# EAGLE schematic DIDV_-_Expansao_10 (EAGLE 6.2)

## Sheet 1 of 4
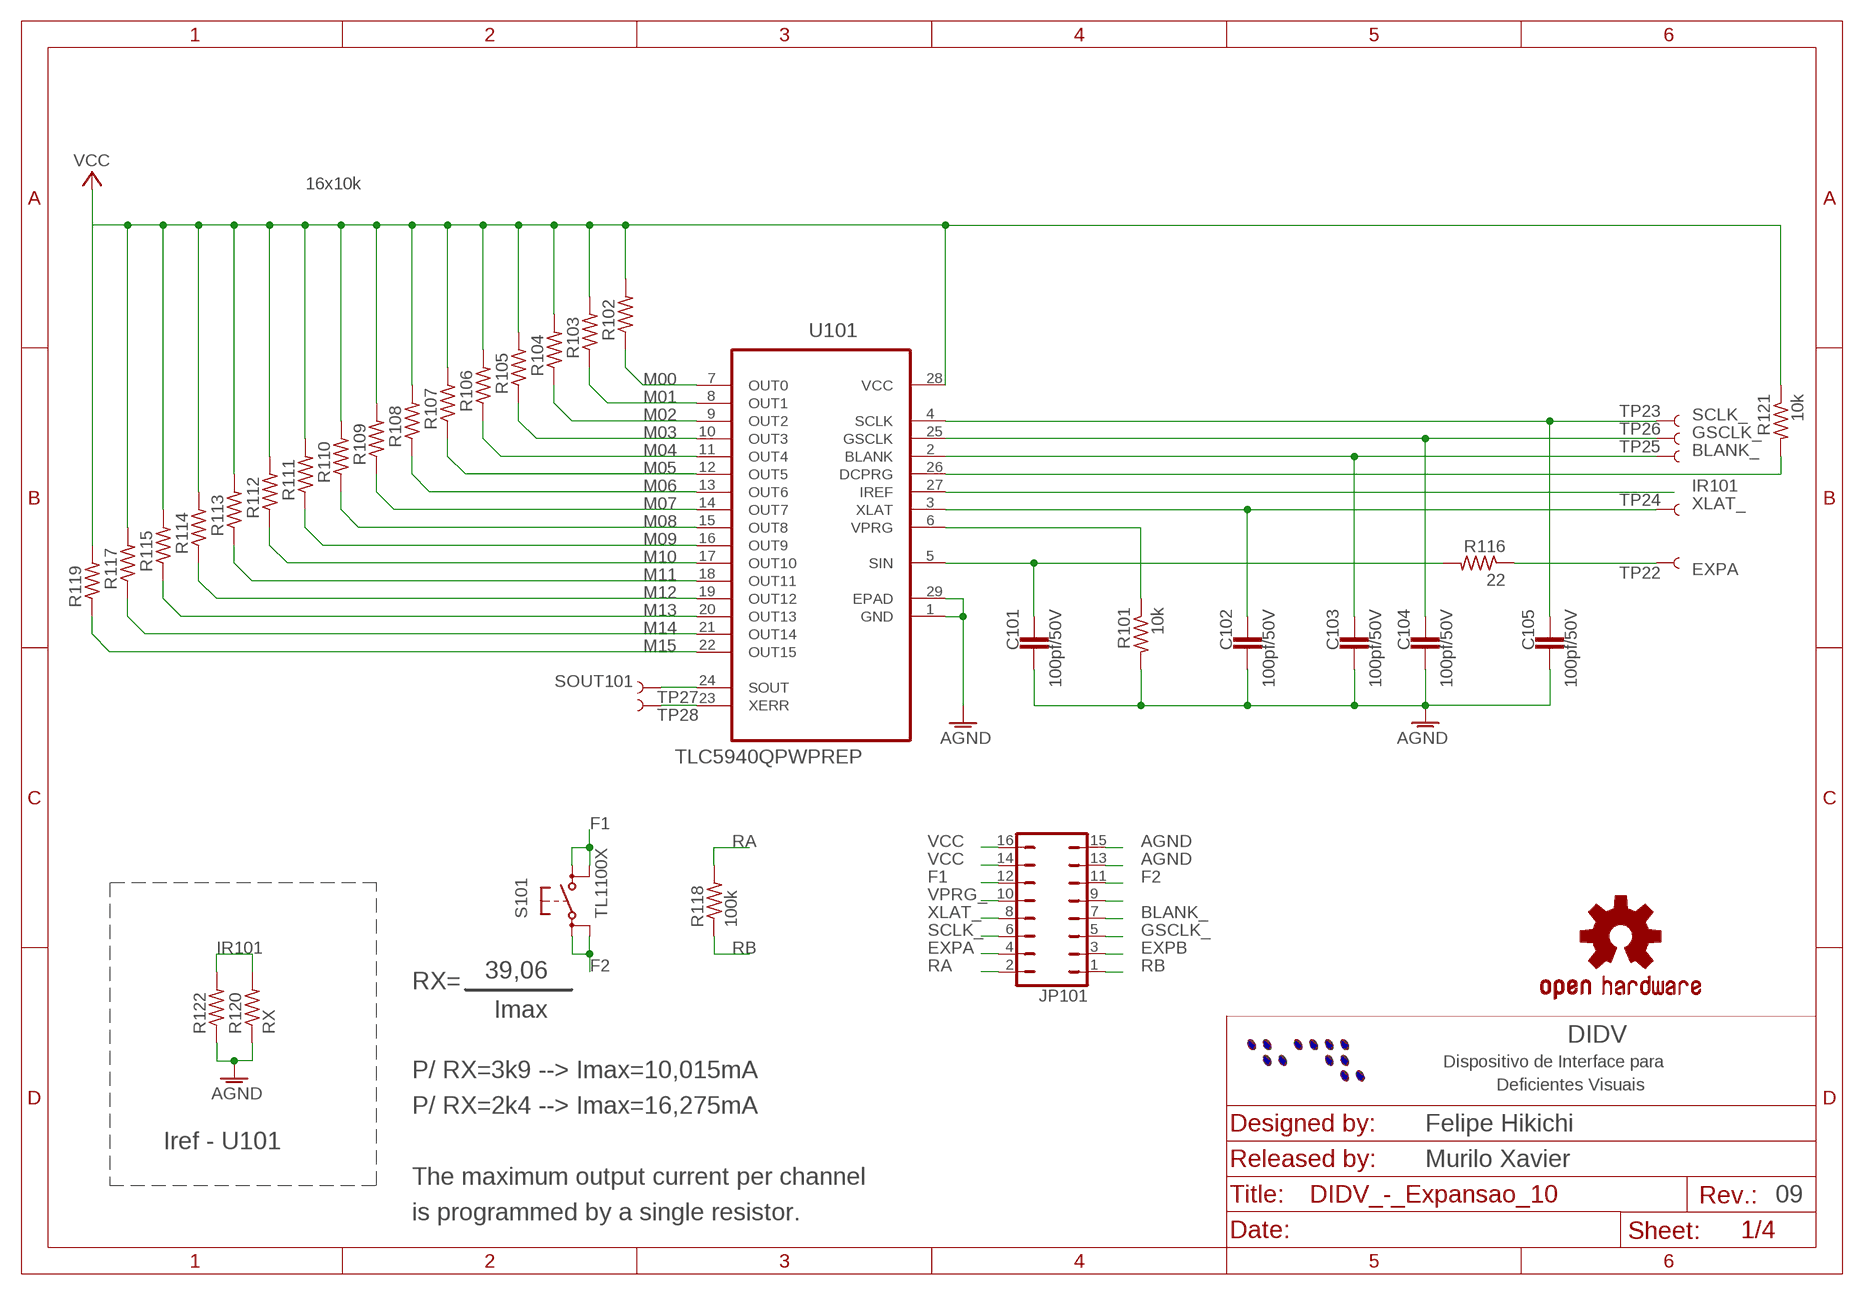
[diagram p0: schematic, sheet 1]

### Parts
C101  100pf/50V  C-EUC0603K  [C0603K]
C102  100pf/50V  C-EUC0603K  [C0603K]
C103  100pf/50V  C-EUC0603K  [C0603K]
C104  100pf/50V  C-EUC0603K  [C0603K]
C105  100pf/50V  C-EUC0603K  [C0603K]
JP101  JP8Q  [JP8Q]
LOGO101  OSHW-LOGOM  [OSHW-LOGO-M]
R101  10k  R-US_R0603  [R0603]
R102  R-US_R0805  [R0805]
R103  R-US_R0805  [R0805]
R104  R-US_R0805  [R0805]
R105  R-US_R0805  [R0805]
R106  R-US_R0805  [R0805]
R107  R-US_R0805  [R0805]
R108  R-US_R0805  [R0805]
R109  R-US_R0805  [R0805]
R110  R-US_R0805  [R0805]
R111  R-US_R0805  [R0805]
R112  R-US_R0805  [R0805]
R113  R-US_R0805  [R0805]
R114  R-US_R0805  [R0805]
R115  R-US_R0805  [R0805]
R116  22  R-US_R0603  [R0603]
R117  R-US_R0805  [R0805]
R118  100k  R-US_R0805  [R0805]
R119  R-US_R0805  [R0805]
R120  RX  R-US_R0805  [R0805]
R121  10k  R-US_R0603  [R0603]
R122  R-US_R0805  [R0805]
S101  TL1100X  [TL1100X]
TP22  TEST-POINT3X4  [PAD.03X.04]
TP23  TEST-POINT3X4  [PAD.03X.04]
TP24  TEST-POINT3X4  [PAD.03X.04]
TP25  TEST-POINT3X4  [PAD.03X.04]
TP26  TEST-POINT3X4  [PAD.03X.04]
TP27  TEST-POINT3X4  [PAD.03X.04]
TP28  TEST-POINT3X4  [PAD.03X.04]
U101  TLC5940QPWPREP  [SOP65P640X120-29N]

### Nets
AGND: C101.1 C102.1 C103.1 C104.1 C105.1 JP101.13 JP101.15 R101.2 R120.1 R122.1 U101.1(GND) U101.29(EPAD) ; also sheet 2,3,4
BLANK_: C103.2 JP101.7 TP25.P$1 U101.2(BLANK) ; also sheet 2,3,4
EXPA: JP101.4 R116.1 TP22.P$1
EXPB: JP101.3 ; also sheet 4
F1: JP101.12 S101.3(S) S101.4(S1)
F2: JP101.11 S101.1(P) S101.2(P1)
GSCLK_: C104.2 JP101.5 TP26.P$1 U101.25(GSCLK) ; also sheet 2,3,4
IR101: R120.2 R122.2 U101.27(IREF)
M00: R102.1 U101.7(OUT0) ; also sheet 2,3,4
M01: R103.1 U101.8(OUT1) ; also sheet 2,3,4
M02: R104.1 U101.9(OUT2) ; also sheet 2,3,4
M03: R105.1 U101.10(OUT3) ; also sheet 2,3,4
M04: R106.1 U101.11(OUT4) ; also sheet 2,3,4
M05: R107.1 U101.12(OUT5) ; also sheet 2,3,4
M06: R108.1 U101.13(OUT6) ; also sheet 2,3,4
M07: R109.1 U101.14(OUT7) ; also sheet 2,3,4
M08: R110.1 U101.15(OUT8) ; also sheet 2,3,4
M09: R111.1 U101.16(OUT9) ; also sheet 2,3,4
M10: R112.1 U101.17(OUT10) ; also sheet 2,3,4
M11: R113.1 U101.18(OUT11) ; also sheet 2,3,4
M12: R114.1 U101.19(OUT12) ; also sheet 2,3,4
M13: R115.1 U101.20(OUT13) ; also sheet 2,3,4
M14: R117.1 U101.21(OUT14) ; also sheet 2,3,4
M15: R119.1 U101.22(OUT15) ; also sheet 2,3,4
N$1: R121.2 U101.26(DCPRG)
N$2: JP101.9
N$4: C101.2 R116.2 U101.5(SIN)
N$10: TP28.P$1 U101.23(XERR)
RA: JP101.2 R118.2
RB: JP101.1 R118.1
SCLK_: C105.2 JP101.6 TP23.P$1 U101.4(SCLK) ; also sheet 2,3,4
SOUT101: TP27.P$1 U101.24(SOUT) ; also sheet 2
VCC: JP101.14 JP101.16 R102.2 R103.2 R104.2 R105.2 R106.2 R107.2 R108.2 R109.2 R110.2 R111.2 R112.2 R113.2 R114.2 R115.2 R117.2 R119.2 R121.1 U101.28(VCC) ; also sheet 2,3,4
VPRG_: JP101.10 R101.1 U101.6(VPRG) ; also sheet 2,3,4
XLAT_: C102.2 JP101.8 TP24.P$1 U101.3(XLAT) ; also sheet 2,3,4

### Notes on the sheet
- 16x10k
- 39,06
- RX=
- Imax
- DIDV
- Dispositivo de Interface para
- P/ RX=3k9 --> Imax=10,015mA
- Deficientes Visuais
- P/ RX=2k4 --> Imax=16,275mA
- Felipe Hikichi
- Iref - U101
- Murilo Xavier
- The maximum output current per channel
- 09
- is programmed by a single resistor.

## Sheet 2 of 4
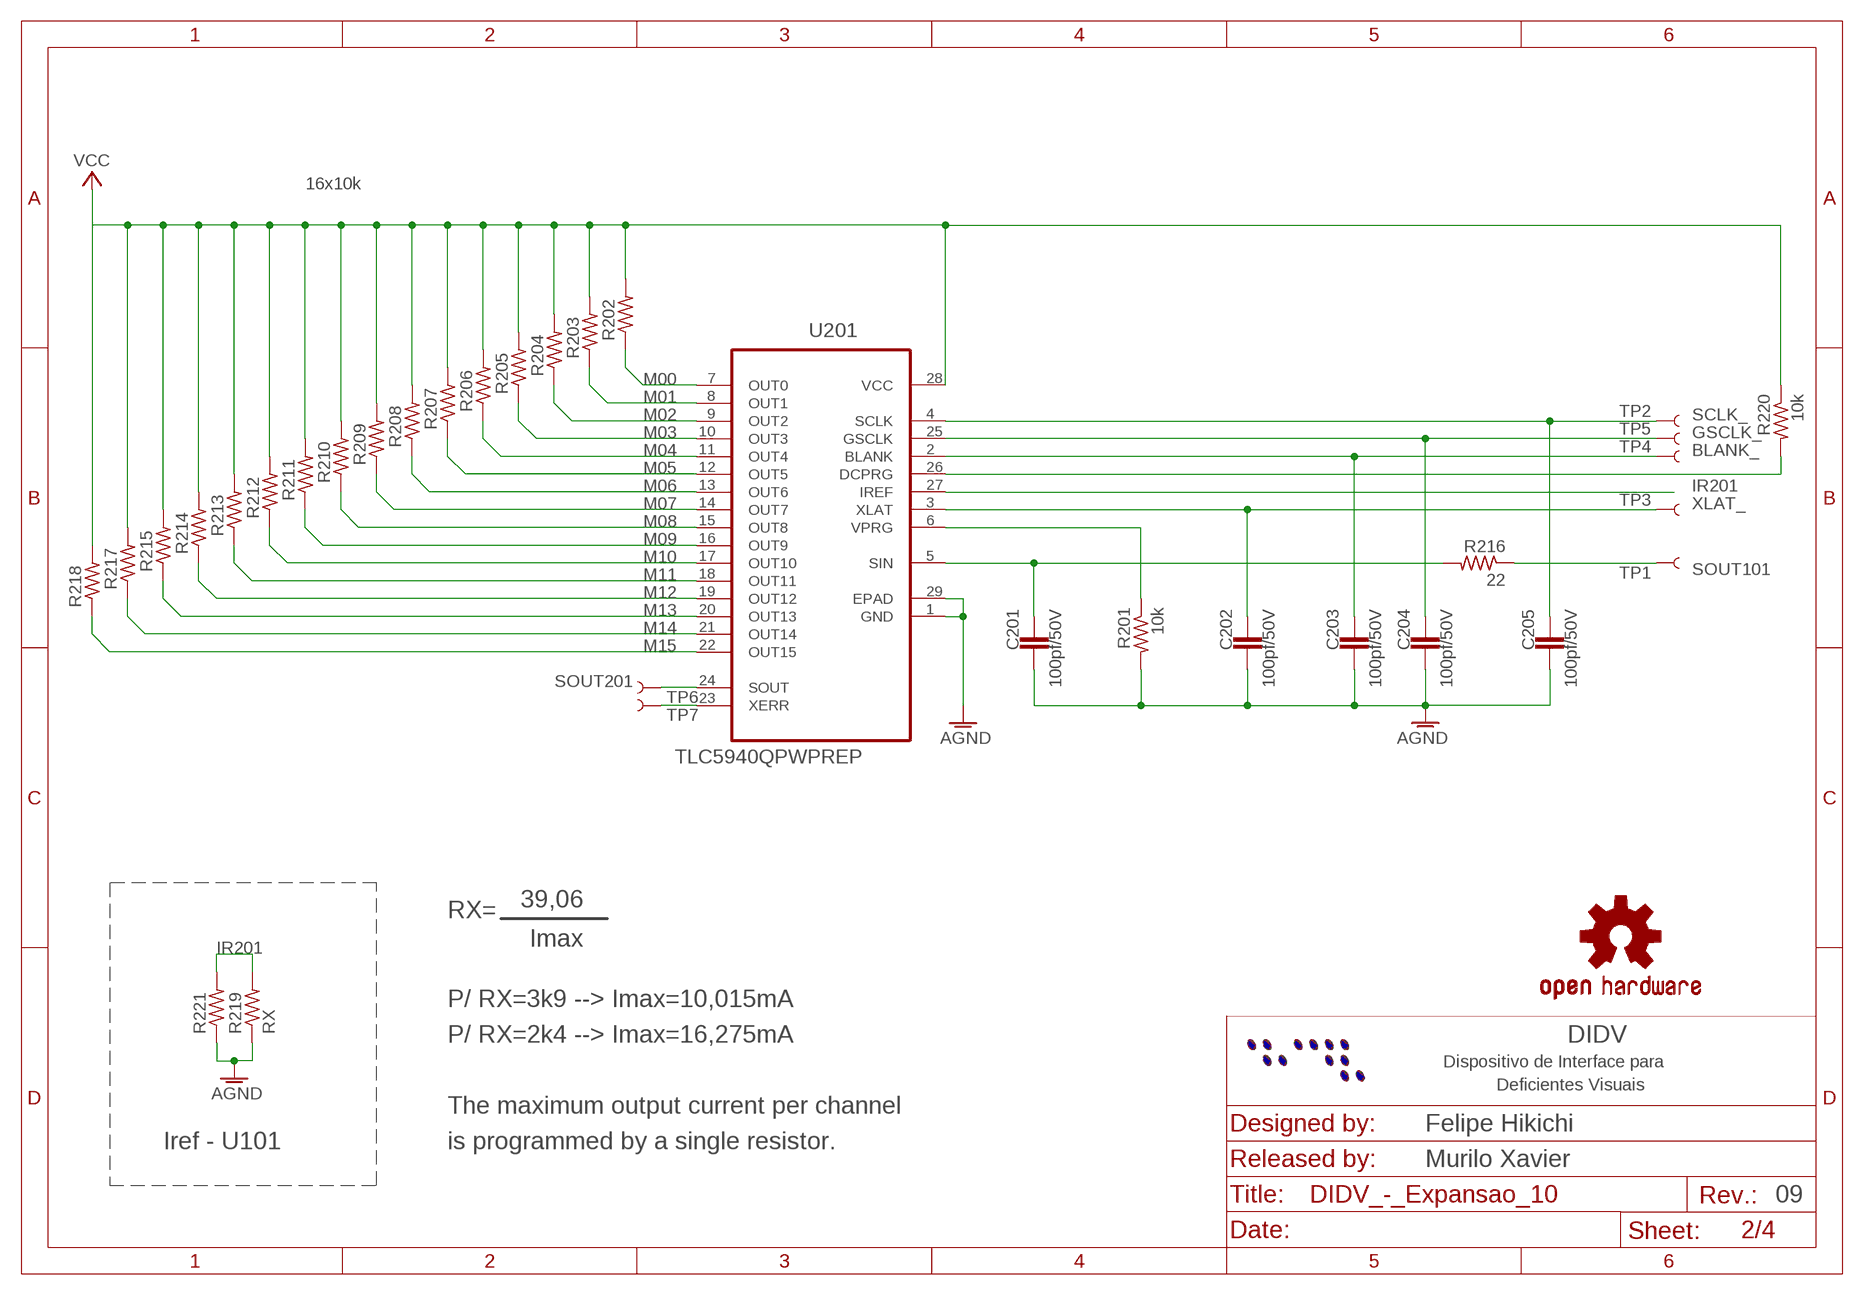
[diagram p1: schematic, sheet 2]

### Parts
C201  100pf/50V  C-EUC0603K  [C0603K]
C202  100pf/50V  C-EUC0603K  [C0603K]
C203  100pf/50V  C-EUC0603K  [C0603K]
C204  100pf/50V  C-EUC0603K  [C0603K]
C205  100pf/50V  C-EUC0603K  [C0603K]
LOGO201  OSHW-LOGOM  [OSHW-LOGO-M]
R201  10k  R-US_R0603  [R0603]
R202  R-US_R0805  [R0805]
R203  R-US_R0805  [R0805]
R204  R-US_R0805  [R0805]
R205  R-US_R0805  [R0805]
R206  R-US_R0805  [R0805]
R207  R-US_R0805  [R0805]
R208  R-US_R0805  [R0805]
R209  R-US_R0805  [R0805]
R210  R-US_R0805  [R0805]
R211  R-US_R0805  [R0805]
R212  R-US_R0805  [R0805]
R213  R-US_R0805  [R0805]
R214  R-US_R0805  [R0805]
R215  R-US_R0805  [R0805]
R216  22  R-US_R0603  [R0603]
R217  R-US_R0805  [R0805]
R218  R-US_R0805  [R0805]
R219  RX  R-US_R0805  [R0805]
R220  10k  R-US_R0603  [R0603]
R221  R-US_R0805  [R0805]
TP1  TEST-POINT3X4  [PAD.03X.04]
TP2  TEST-POINT3X4  [PAD.03X.04]
TP3  TEST-POINT3X4  [PAD.03X.04]
TP4  TEST-POINT3X4  [PAD.03X.04]
TP5  TEST-POINT3X4  [PAD.03X.04]
TP6  TEST-POINT3X4  [PAD.03X.04]
TP7  TEST-POINT3X4  [PAD.03X.04]
U201  TLC5940QPWPREP  [SOP65P640X120-29N]

### Nets
AGND: C201.1 C202.1 C203.1 C204.1 C205.1 R201.2 R219.1 R221.1 U201.1(GND) U201.29(EPAD) ; also sheet 1,3,4
BLANK_: C203.2 TP4.P$1 U201.2(BLANK) ; also sheet 1,3,4
GSCLK_: C204.2 TP5.P$1 U201.25(GSCLK) ; also sheet 1,3,4
IR201: R219.2 R221.2 U201.27(IREF)
M00: R202.1 U201.7(OUT0) ; also sheet 1,3,4
M01: R203.1 U201.8(OUT1) ; also sheet 1,3,4
M02: R204.1 U201.9(OUT2) ; also sheet 1,3,4
M03: R205.1 U201.10(OUT3) ; also sheet 1,3,4
M04: R206.1 U201.11(OUT4) ; also sheet 1,3,4
M05: R207.1 U201.12(OUT5) ; also sheet 1,3,4
M06: R208.1 U201.13(OUT6) ; also sheet 1,3,4
M07: R209.1 U201.14(OUT7) ; also sheet 1,3,4
M08: R210.1 U201.15(OUT8) ; also sheet 1,3,4
M09: R211.1 U201.16(OUT9) ; also sheet 1,3,4
M10: R212.1 U201.17(OUT10) ; also sheet 1,3,4
M11: R213.1 U201.18(OUT11) ; also sheet 1,3,4
M12: R214.1 U201.19(OUT12) ; also sheet 1,3,4
M13: R215.1 U201.20(OUT13) ; also sheet 1,3,4
M14: R217.1 U201.21(OUT14) ; also sheet 1,3,4
M15: R218.1 U201.22(OUT15) ; also sheet 1,3,4
N$3: C201.2 R216.2 U201.5(SIN)
N$5: TP7.P$1 U201.23(XERR)
N$6: R220.2 U201.26(DCPRG)
SCLK_: C205.2 TP2.P$1 U201.4(SCLK) ; also sheet 1,3,4
SOUT101: R216.1 TP1.P$1 ; also sheet 1
SOUT201: TP6.P$1 U201.24(SOUT) ; also sheet 3
VCC: R202.2 R203.2 R204.2 R205.2 R206.2 R207.2 R208.2 R209.2 R210.2 R211.2 R212.2 R213.2 R214.2 R215.2 R217.2 R218.2 R220.1 U201.28(VCC) ; also sheet 1,3,4
VPRG_: R201.1 U201.6(VPRG) ; also sheet 1,3,4
XLAT_: C202.2 TP3.P$1 U201.3(XLAT) ; also sheet 1,3,4

### Notes on the sheet
- 16x10k
- 39,06
- RX=
- Imax
- P/ RX=3k9 --> Imax=10,015mA
- P/ RX=2k4 --> Imax=16,275mA | DIDV
- Dispositivo de Interface para
- Deficientes Visuais
- The maximum output current per channel
- Felipe Hikichi
- Iref - U101 | is programmed by a single resistor.
- Murilo Xavier
- 09

## Sheet 3 of 4
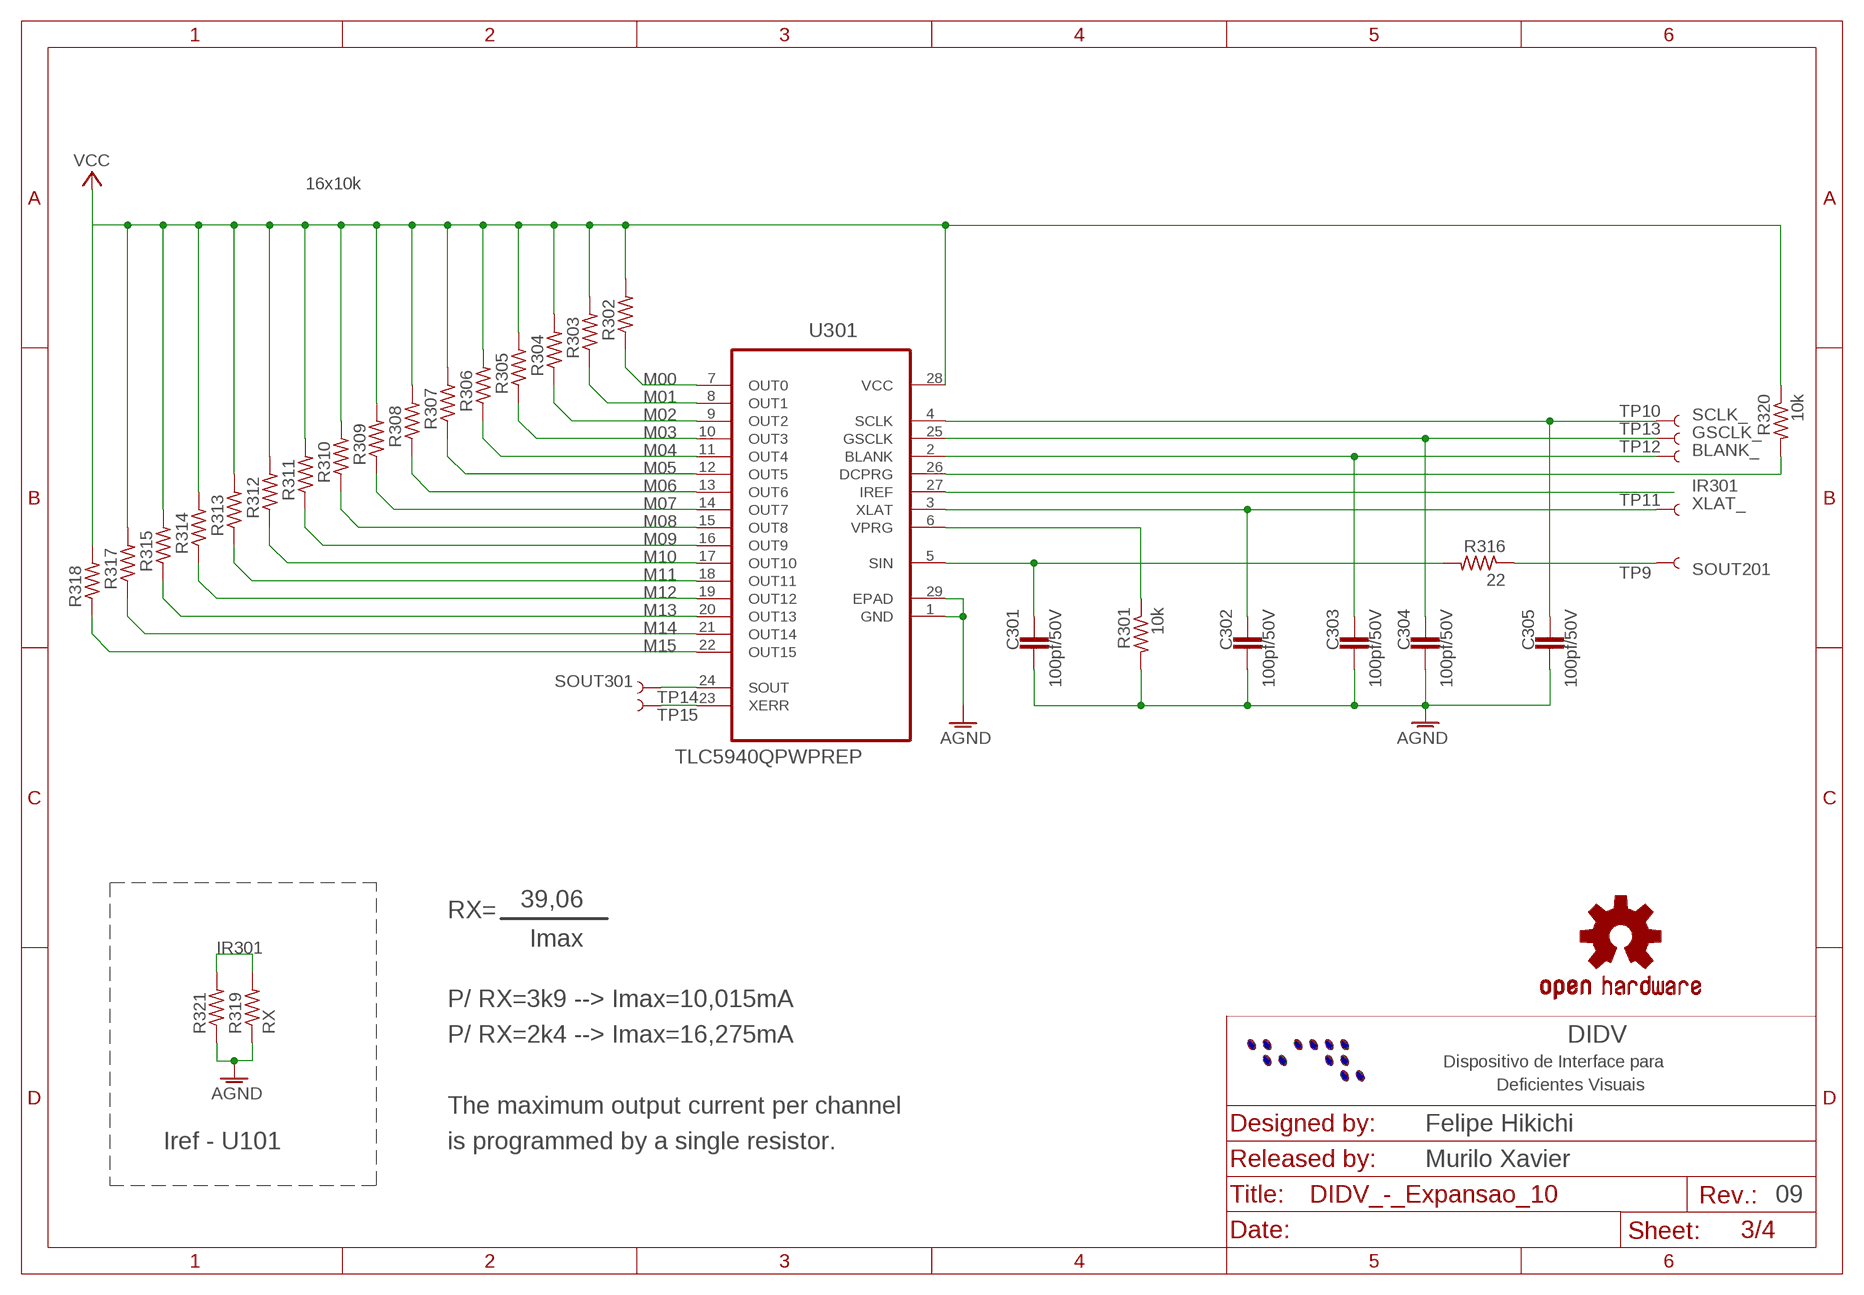
[diagram p2: schematic, sheet 3]

### Parts
C301  100pf/50V  C-EUC0603K  [C0603K]
C302  100pf/50V  C-EUC0603K  [C0603K]
C303  100pf/50V  C-EUC0603K  [C0603K]
C304  100pf/50V  C-EUC0603K  [C0603K]
C305  100pf/50V  C-EUC0603K  [C0603K]
LOGO301  OSHW-LOGOM  [OSHW-LOGO-M]
R301  10k  R-US_R0603  [R0603]
R302  R-US_R0805  [R0805]
R303  R-US_R0805  [R0805]
R304  R-US_R0805  [R0805]
R305  R-US_R0805  [R0805]
R306  R-US_R0805  [R0805]
R307  R-US_R0805  [R0805]
R308  R-US_R0805  [R0805]
R309  R-US_R0805  [R0805]
R310  R-US_R0805  [R0805]
R311  R-US_R0805  [R0805]
R312  R-US_R0805  [R0805]
R313  R-US_R0805  [R0805]
R314  R-US_R0805  [R0805]
R315  R-US_R0805  [R0805]
R316  22  R-US_R0603  [R0603]
R317  R-US_R0805  [R0805]
R318  R-US_R0805  [R0805]
R319  RX  R-US_R0805  [R0805]
R320  10k  R-US_R0603  [R0603]
R321  R-US_R0805  [R0805]
TP9  TEST-POINT3X4  [PAD.03X.04]
TP10  TEST-POINT3X4  [PAD.03X.04]
TP11  TEST-POINT3X4  [PAD.03X.04]
TP12  TEST-POINT3X4  [PAD.03X.04]
TP13  TEST-POINT3X4  [PAD.03X.04]
TP14  TEST-POINT3X4  [PAD.03X.04]
TP15  TEST-POINT3X4  [PAD.03X.04]
U301  TLC5940QPWPREP  [SOP65P640X120-29N]

### Nets
AGND: C301.1 C302.1 C303.1 C304.1 C305.1 R301.2 R319.1 R321.1 U301.1(GND) U301.29(EPAD) ; also sheet 1,2,4
BLANK_: C303.2 TP12.P$1 U301.2(BLANK) ; also sheet 1,2,4
GSCLK_: C304.2 TP13.P$1 U301.25(GSCLK) ; also sheet 1,2,4
IR301: R319.2 R321.2 U301.27(IREF)
M00: R302.1 U301.7(OUT0) ; also sheet 1,2,4
M01: R303.1 U301.8(OUT1) ; also sheet 1,2,4
M02: R304.1 U301.9(OUT2) ; also sheet 1,2,4
M03: R305.1 U301.10(OUT3) ; also sheet 1,2,4
M04: R306.1 U301.11(OUT4) ; also sheet 1,2,4
M05: R307.1 U301.12(OUT5) ; also sheet 1,2,4
M06: R308.1 U301.13(OUT6) ; also sheet 1,2,4
M07: R309.1 U301.14(OUT7) ; also sheet 1,2,4
M08: R310.1 U301.15(OUT8) ; also sheet 1,2,4
M09: R311.1 U301.16(OUT9) ; also sheet 1,2,4
M10: R312.1 U301.17(OUT10) ; also sheet 1,2,4
M11: R313.1 U301.18(OUT11) ; also sheet 1,2,4
M12: R314.1 U301.19(OUT12) ; also sheet 1,2,4
M13: R315.1 U301.20(OUT13) ; also sheet 1,2,4
M14: R317.1 U301.21(OUT14) ; also sheet 1,2,4
M15: R318.1 U301.22(OUT15) ; also sheet 1,2,4
N$8: C301.2 R316.2 U301.5(SIN)
N$9: TP15.P$1 U301.23(XERR)
N$11: R320.2 U301.26(DCPRG)
SCLK_: C305.2 TP10.P$1 U301.4(SCLK) ; also sheet 1,2,4
SOUT201: R316.1 TP9.P$1 ; also sheet 2
SOUT301: TP14.P$1 U301.24(SOUT) ; also sheet 4
VCC: R302.2 R303.2 R304.2 R305.2 R306.2 R307.2 R308.2 R309.2 R310.2 R311.2 R312.2 R313.2 R314.2 R315.2 R317.2 R318.2 R320.1 U301.28(VCC) ; also sheet 1,2,4
VPRG_: R301.1 U301.6(VPRG) ; also sheet 1,2,4
XLAT_: C302.2 TP11.P$1 U301.3(XLAT) ; also sheet 1,2,4

### Notes on the sheet
- 16x10k
- 39,06
- RX=
- Imax
- P/ RX=3k9 --> Imax=10,015mA
- P/ RX=2k4 --> Imax=16,275mA | DIDV
- Dispositivo de Interface para
- Deficientes Visuais
- The maximum output current per channel
- Felipe Hikichi
- Iref - U101 | is programmed by a single resistor.
- Murilo Xavier
- 09

## Sheet 4 of 4
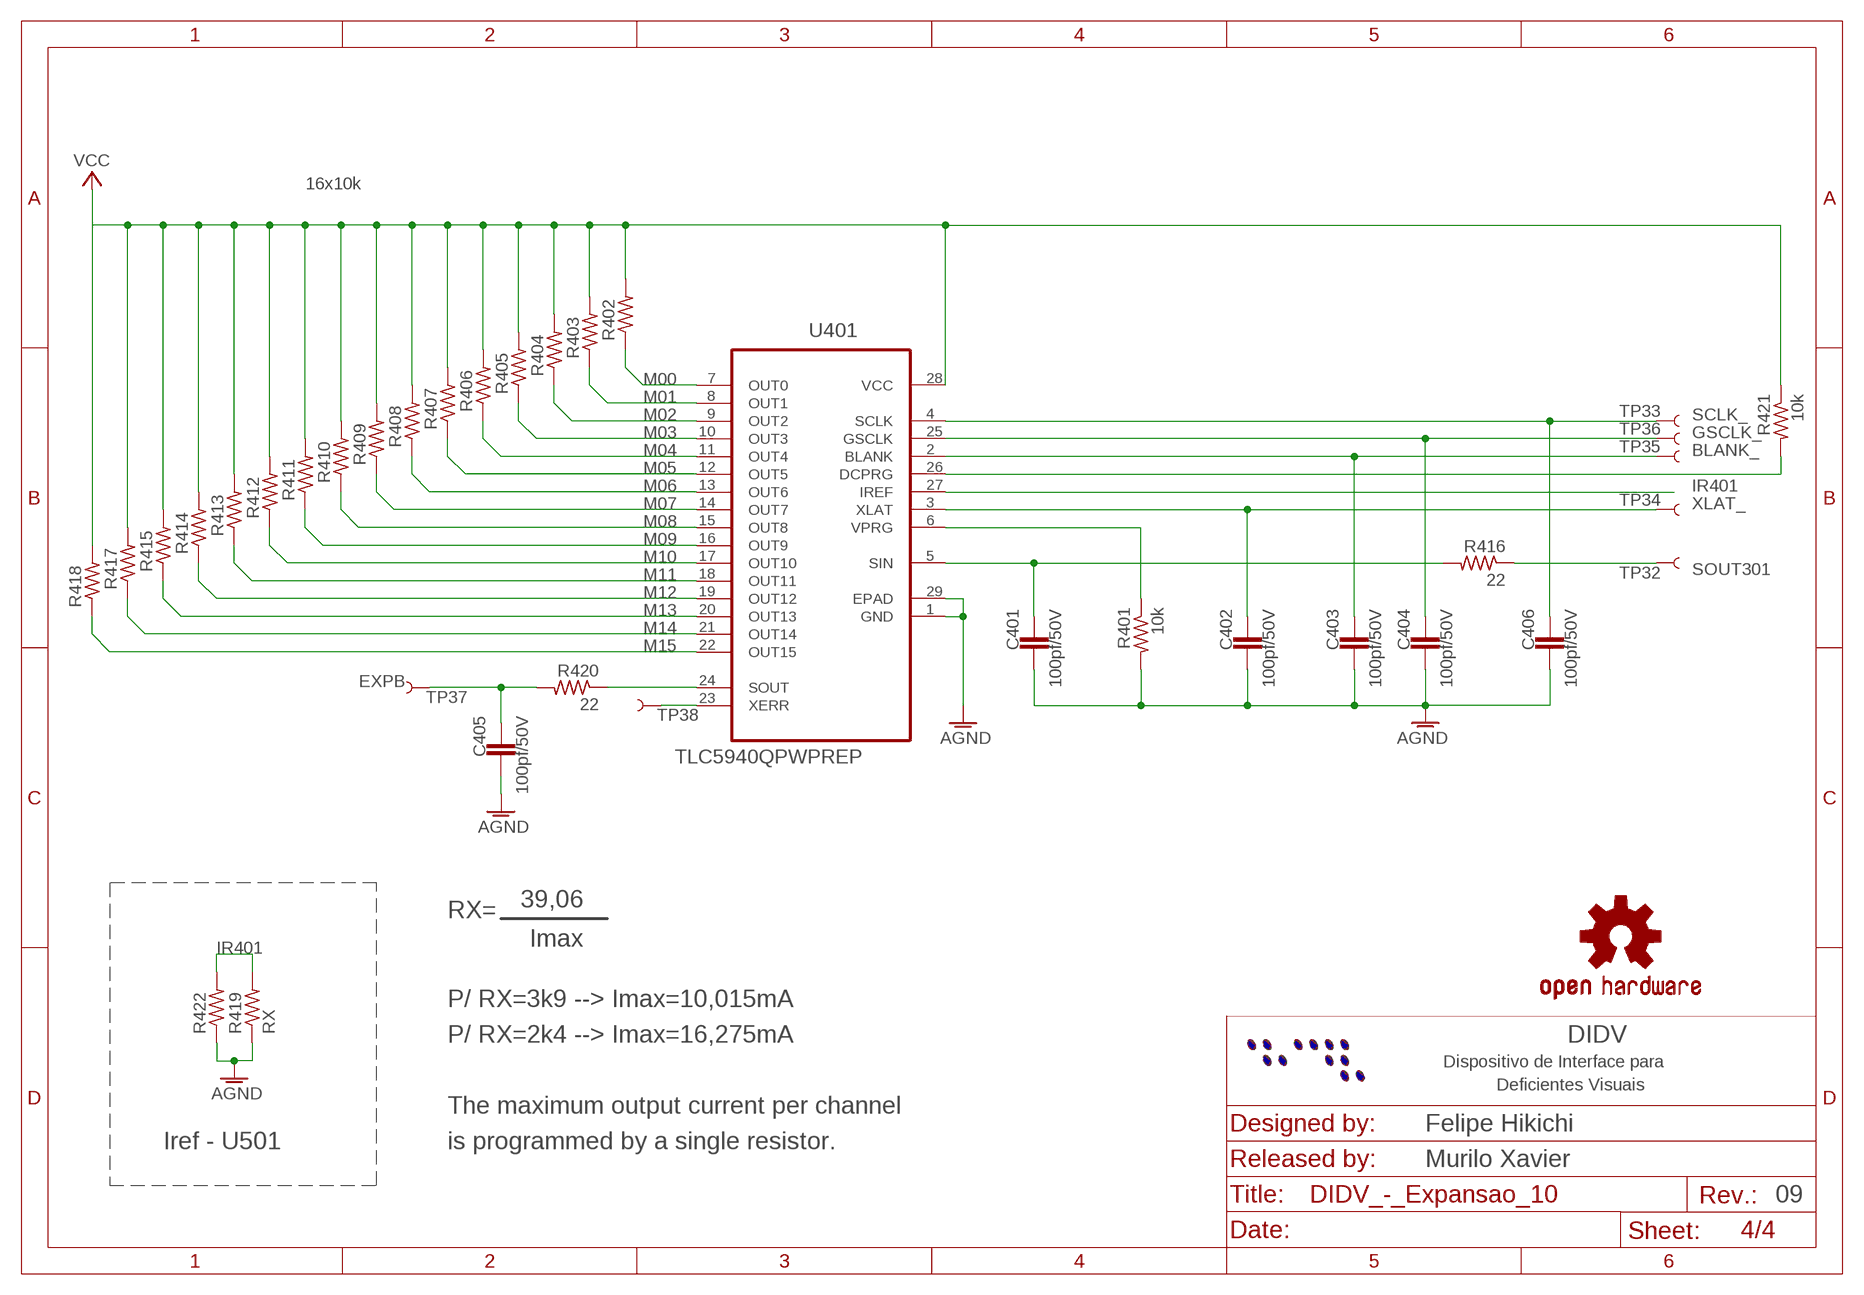
[diagram p3: schematic, sheet 4]

### Parts
C401  100pf/50V  C-EUC0603K  [C0603K]
C402  100pf/50V  C-EUC0603K  [C0603K]
C403  100pf/50V  C-EUC0603K  [C0603K]
C404  100pf/50V  C-EUC0603K  [C0603K]
C405  100pf/50V  C-EUC0603K  [C0603K]
C406  100pf/50V  C-EUC0603K  [C0603K]
LOGO401  OSHW-LOGOM  [OSHW-LOGO-M]
R401  10k  R-US_R0603  [R0603]
R402  R-US_R0805  [R0805]
R403  R-US_R0805  [R0805]
R404  R-US_R0805  [R0805]
R405  R-US_R0805  [R0805]
R406  R-US_R0805  [R0805]
R407  R-US_R0805  [R0805]
R408  R-US_R0805  [R0805]
R409  R-US_R0805  [R0805]
R410  R-US_R0805  [R0805]
R411  R-US_R0805  [R0805]
R412  R-US_R0805  [R0805]
R413  R-US_R0805  [R0805]
R414  R-US_R0805  [R0805]
R415  R-US_R0805  [R0805]
R416  22  R-US_R0603  [R0603]
R417  R-US_R0805  [R0805]
R418  R-US_R0805  [R0805]
R419  RX  R-US_R0805  [R0805]
R420  22  R-US_R0603  [R0603]
R421  10k  R-US_R0603  [R0603]
R422  R-US_R0805  [R0805]
TP32  TEST-POINT3X4  [PAD.03X.04]
TP33  TEST-POINT3X4  [PAD.03X.04]
TP34  TEST-POINT3X4  [PAD.03X.04]
TP35  TEST-POINT3X4  [PAD.03X.04]
TP36  TEST-POINT3X4  [PAD.03X.04]
TP37  TEST-POINT3X4  [PAD.03X.04]
TP38  TEST-POINT3X4  [PAD.03X.04]
U401  TLC5940QPWPREP  [SOP65P640X120-29N]

### Nets
AGND: C401.1 C402.1 C403.1 C404.1 C405.1 C406.1 R401.2 R419.1 R422.1 U401.1(GND) U401.29(EPAD) ; also sheet 1,2,3
BLANK_: C403.2 TP35.P$1 U401.2(BLANK) ; also sheet 1,2,3
EXPB: C405.2 R420.2 TP37.P$1 ; also sheet 1
GSCLK_: C404.2 TP36.P$1 U401.25(GSCLK) ; also sheet 1,2,3
IR401: R419.2 R422.2 U401.27(IREF)
M00: R402.1 U401.7(OUT0) ; also sheet 1,2,3
M01: R403.1 U401.8(OUT1) ; also sheet 1,2,3
M02: R404.1 U401.9(OUT2) ; also sheet 1,2,3
M03: R405.1 U401.10(OUT3) ; also sheet 1,2,3
M04: R406.1 U401.11(OUT4) ; also sheet 1,2,3
M05: R407.1 U401.12(OUT5) ; also sheet 1,2,3
M06: R408.1 U401.13(OUT6) ; also sheet 1,2,3
M07: R409.1 U401.14(OUT7) ; also sheet 1,2,3
M08: R410.1 U401.15(OUT8) ; also sheet 1,2,3
M09: R411.1 U401.16(OUT9) ; also sheet 1,2,3
M10: R412.1 U401.17(OUT10) ; also sheet 1,2,3
M11: R413.1 U401.18(OUT11) ; also sheet 1,2,3
M12: R414.1 U401.19(OUT12) ; also sheet 1,2,3
M13: R415.1 U401.20(OUT13) ; also sheet 1,2,3
M14: R417.1 U401.21(OUT14) ; also sheet 1,2,3
M15: R418.1 U401.22(OUT15) ; also sheet 1,2,3
N$39: C401.2 R416.2 U401.5(SIN)
N$40: TP38.P$1 U401.23(XERR)
N$69: R421.2 U401.26(DCPRG)
N$71: R420.1 U401.24(SOUT)
SCLK_: C406.2 TP33.P$1 U401.4(SCLK) ; also sheet 1,2,3
SOUT301: R416.1 TP32.P$1 ; also sheet 3
VCC: R402.2 R403.2 R404.2 R405.2 R406.2 R407.2 R408.2 R409.2 R410.2 R411.2 R412.2 R413.2 R414.2 R415.2 R417.2 R418.2 R421.1 U401.28(VCC) ; also sheet 1,2,3
VPRG_: R401.1 U401.6(VPRG) ; also sheet 1,2,3
XLAT_: C402.2 TP34.P$1 U401.3(XLAT) ; also sheet 1,2,3

### Notes on the sheet
- 16x10k
- 39,06
- RX=
- Imax
- P/ RX=3k9 --> Imax=10,015mA
- P/ RX=2k4 --> Imax=16,275mA | DIDV
- Dispositivo de Interface para
- Deficientes Visuais
- The maximum output current per channel
- Felipe Hikichi
- Iref - U501 | is programmed by a single resistor.
- Murilo Xavier
- 09

## Library data of the parts
C101-C105 C201-C205 C301-C305 C401-C406 = rcl:C-EU: CAPACITOR, European symbol
JP101 = jumper:JP8Q: JUMPER
LOGO101 LOGO201 LOGO301 LOGO401 = SparkFun-Aesthetics:OSHW-LOGO: Open Source Hardware Logo This logo indicates the piece of hardware it is found on incorporates a OSHW license and/or adheres to the definition of open source hardware found here: http://freedomdefined.org/OSHW
R101-R122 R201-R221 R301-R321 R401-R422 = rcl:R-US_: RESISTOR, American symbol
S101 = switch-e-switch:TL1100X: TACTILE SWITCH
TP1-TP7 TP9-TP15 TP22-TP28 TP32-TP38 = SparkFun-Passives:TEST-POINT: Bare copper test points for troubleshooting or ICT
U101 U201 U301 U401 = Texas Instruments_By_element14_Batch_1:TLC5940QPWPREP: 16-CHANNEL LED DRIVER; MPN: TLC5940QPWPREP; OC_FARNELL: -; OC_NEWARK: 79R8509; PACKAGE: TSSOP-28; SUPPLIER: Texas Instruments